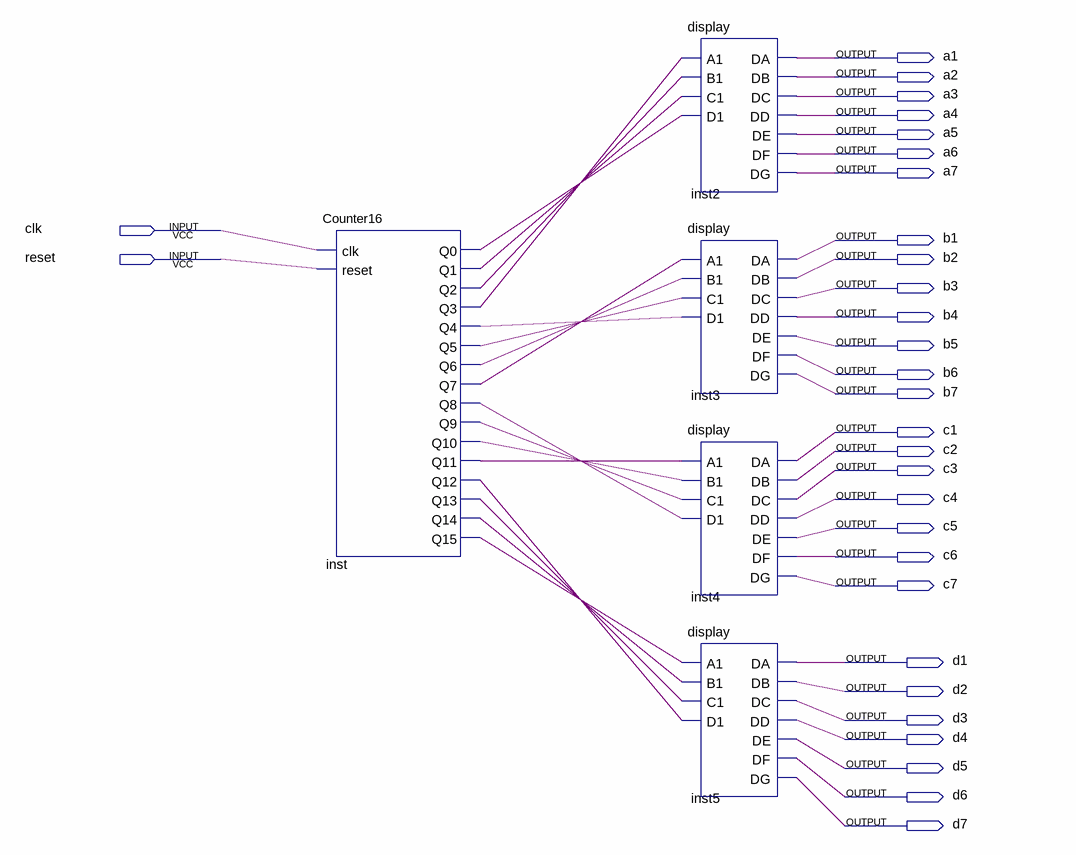
[diagram p0: schematic sheet]
// Quartus schematic count16bits.bdf as structural Verilog: 5 symbols, 30 pins
module count16bits (
  input  clk,
  input  reset,
  output a1,
  output a2,
  output a3,
  output a4,
  output a5,
  output a6,
  output a7,
  output b1,
  output b2,
  output b3,
  output b4,
  output b5,
  output b6,
  output b7,
  output c1,
  output c2,
  output c3,
  output c4,
  output c5,
  output c6,
  output c7,
  output d1,
  output d2,
  output d3,
  output d4,
  output d5,
  output d6,
  output d7
);

  wire inst_q0, inst_q1, inst_q2, inst_q3, inst_q4, inst_q5, inst_q6, inst_q7, inst_q8, inst_q9, inst_q10,
       inst_q11, inst_q12, inst_q13, inst_q14, inst_q15;

  Counter16 inst (
    .clk(clk), .reset(reset), .Q0(inst_q0), .Q1(inst_q1), .Q2(inst_q2), .Q3(inst_q3), .Q4(inst_q4),
    .Q5(inst_q5), .Q6(inst_q6), .Q7(inst_q7), .Q8(inst_q8), .Q9(inst_q9), .Q10(inst_q10), .Q11(inst_q11),
    .Q12(inst_q12), .Q13(inst_q13), .Q14(inst_q14), .Q15(inst_q15));
  display inst2 (
    .A1(inst_q3), .B1(inst_q2), .C1(inst_q1), .D1(inst_q0), .DA(a1), .DB(a2), .DC(a3), .DD(a4), .DE(a5),
    .DF(a6), .DG(a7));
  display inst3 (
    .A1(inst_q7), .B1(inst_q6), .C1(inst_q5), .D1(inst_q4), .DA(b1), .DB(b2), .DC(b3), .DD(b4), .DE(b5),
    .DF(b6), .DG(b7));
  display inst4 (
    .A1(inst_q11), .B1(inst_q10), .C1(inst_q9), .D1(inst_q8), .DA(c1), .DB(c2), .DC(c3), .DD(c4), .DE(c5),
    .DF(c6), .DG(c7));
  display inst5 (
    .A1(inst_q15), .B1(inst_q14), .C1(inst_q13), .D1(inst_q12), .DA(d1), .DB(d2), .DC(d3), .DD(d4), .DE(d5),
    .DF(d6), .DG(d7));
endmodule
